# EasyEDA Pro project ProPrj_ESP32C3_UARTLogger_2025-09-07.epro, board PCB2
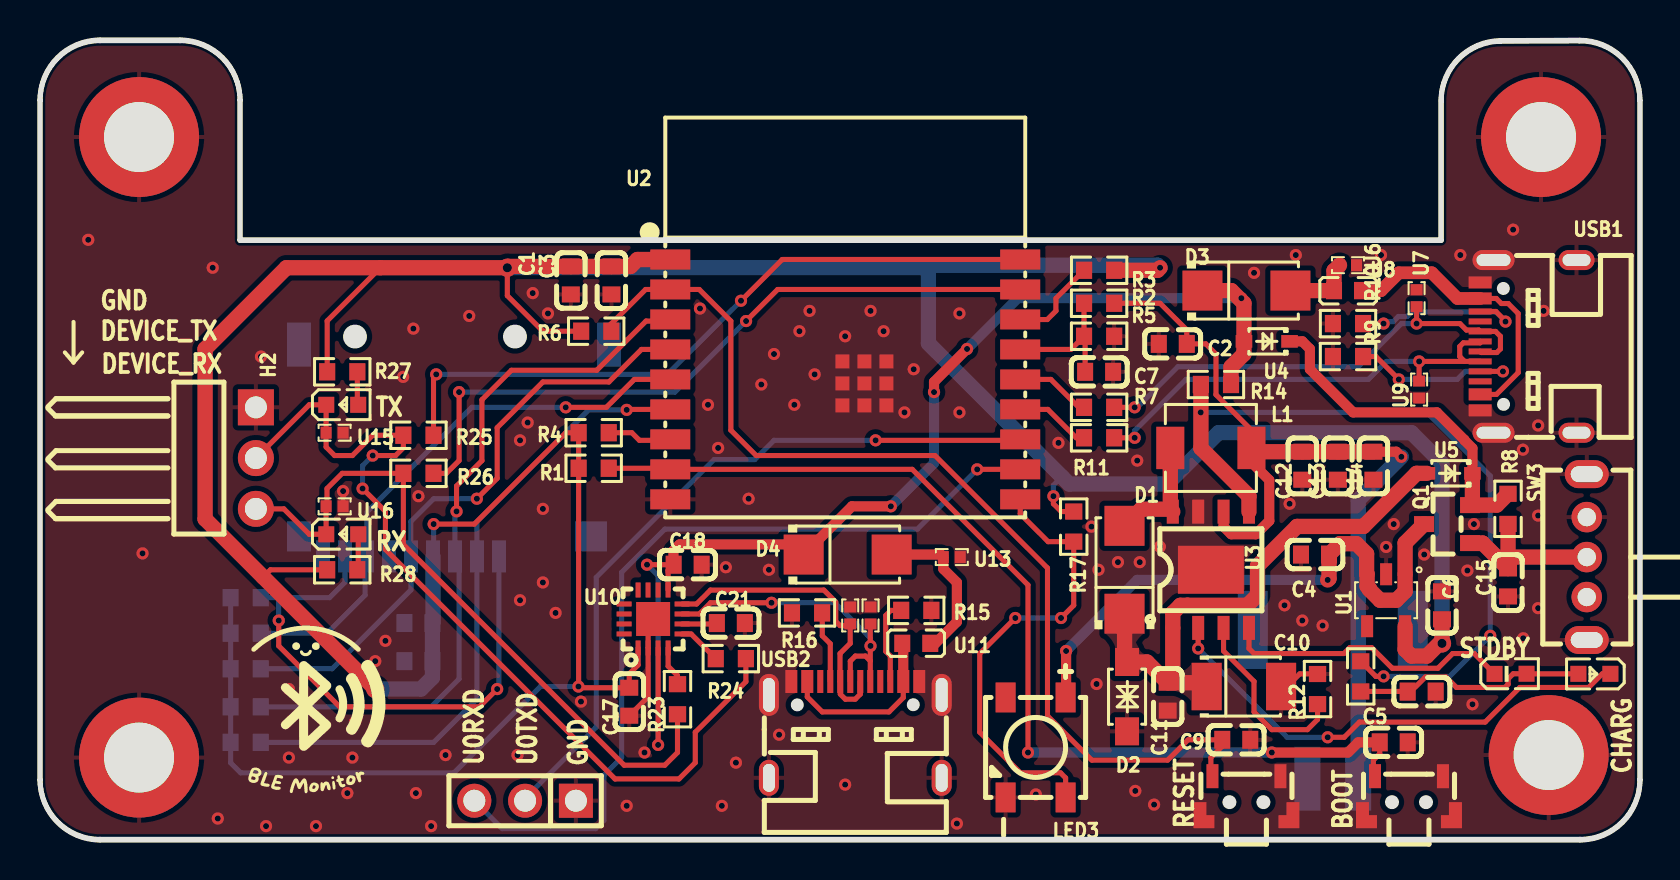
[diagram p4: board, top side]
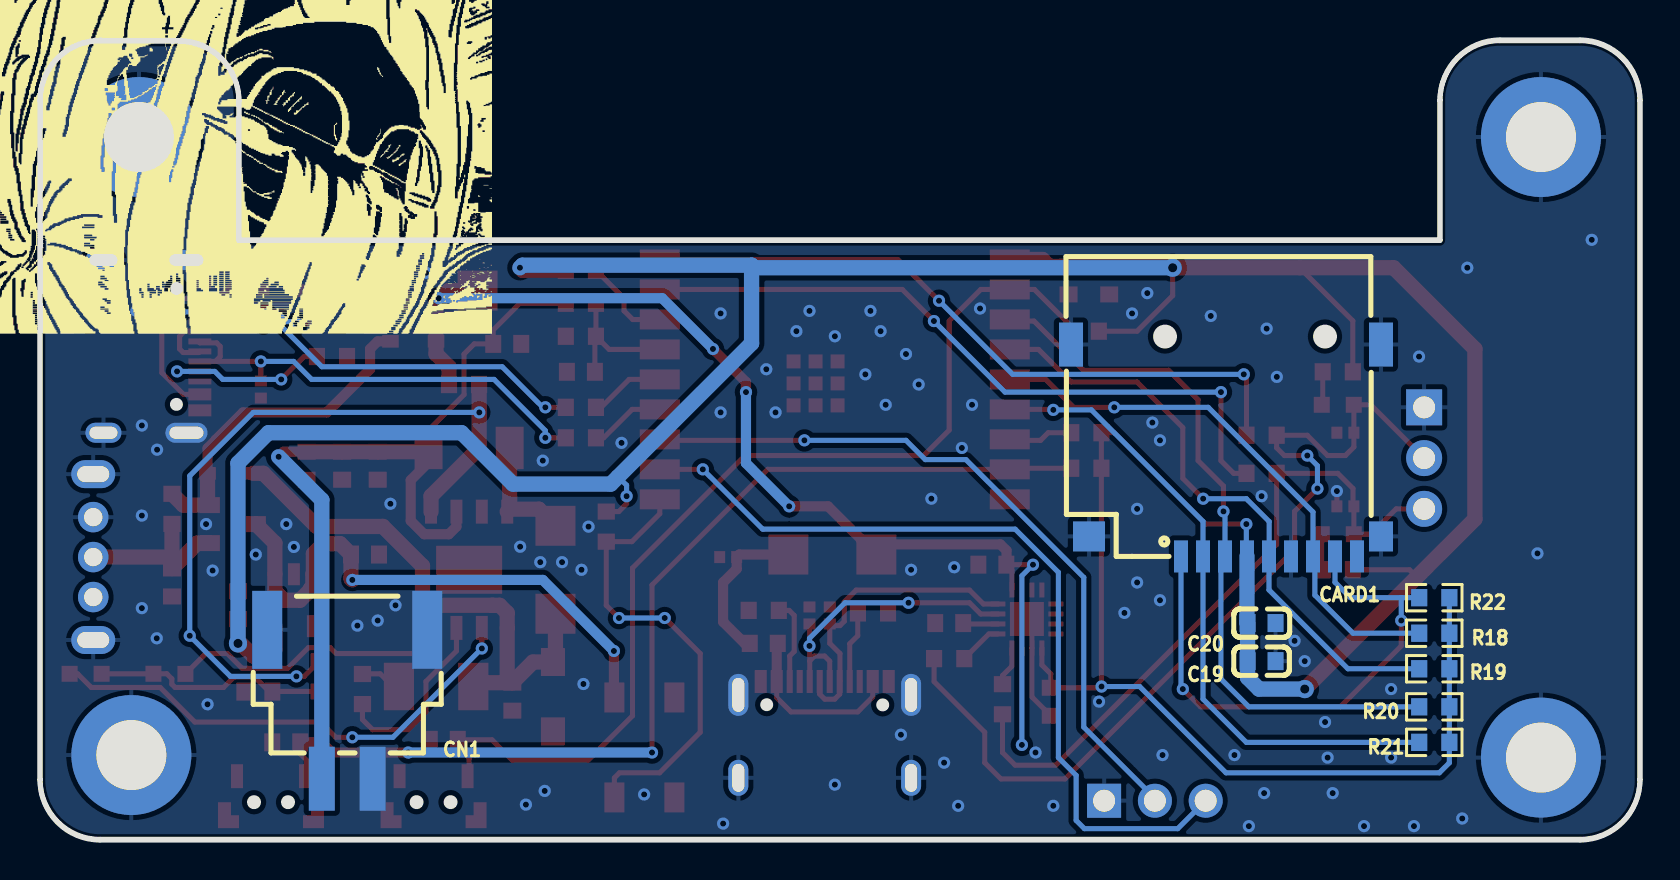
[diagram p5: board, bottom side, seen from below]

Outline 80 x 40.03 mm; copper layers: Top Layer, Bottom Layer. Coordinates in mm from the lower left corner of the outline.
Outline path: 0,37.03 arc(0.88,39.15) 3,40.03 7,40.03 arc(9.12,39.15) 10,37.03 10,30.03 70.06,30.03 70.06,37 arc(70.93,39.12) 73.04,40 76.99,40.02 arc(79.12,39.15) 80,37.02 80,3.03 arc(79.12,0.91) 77,0.03 3,0.03 arc(0.88,0.91) 0,3.03 0,37.03 ; 0,37 arc(0.88,39.12) 3,40 7,40 arc(9.13,39.12) 10,37 10,30 70.06,30 70.06,36.97 arc(70.94,39.08) 73.05,39.97 76.99,39.99 arc(79.12,39.11) 80,36.99 80,3 arc(79.13,0.88) 77,0 3,0 arc(0.88,0.88) 0,3 0,37
Stack: Top Layer 0.035mm / Dielectric1 1.51mm FR4 er 4.5 / Bottom Layer 0.035mm

## Design rules (mm)
template: JLCPCB Capability(Two Layers Board)
spacing copperThickness1oz (default): track to track 0.102, other pairs 0.152 to 0.3
spacing copperThickness2oz: track to track 0.203, other pairs 0.152 to 0.3
track width copperThickness1oz (default): min 0.127, default 0.254, max 2.54
track width copperThickness2oz: min 0.203, default 0.254, max 2.54
differential pair differentialPair (default): width min 0.127, default 0.254, max 2.54; gap min 0.152, default 0.152
via viaSize (default): diameter min 0.5, default 0.61, max 10; hole min 0.3, default 0.305, max 6.3

## Placement (name value [footprint] x y rotation side)
C1  10uF  [C0603]  26.54 28 90 top
C2  100nF  [C0603]  56.64 24.83 0 top
C3  100nF  [C0603]  28.57 28 90 top
C4  10uF  [C0603]  63.75 14.28 0 top
C5  100nF  [C0603]  67.69 4.89 0 top
C6  10uF  [C0603]  70.1 11.75 270 top
C7  100nF  [C0603]  52.96 23.43 180 top
C9  100nF  [C0603]  59.82 5.01 0 top
C10  100uF  [CASE-B_3528]  60.2 7.68 0 top
C11  1uF  [C0603]  56.39 7.17 270 top
C12  100nF  [C0603]  63.12 18.73 90 top
C13  22uF  [C0603]  64.9 18.73 90 top
C14  22uF  [C0603]  66.68 18.73 90 top
C15  100nF  [C0603]  73.41 12.89 90 top
C16  22uF  [C0603]  69.09 7.43 180 top
C17  100nF  [C0603]  29.46 6.92 270 top
C18  100nF  [C0603]  32.38 13.78 0 top
C19  10uF  [C0603]  18.92 8.95 0 bottom
C20  100nF  [C0603]  18.92 10.86 0 bottom
C21  100nF  [C0603]  34.54 10.86 180 top
CARD1  TF PUSH  [TF-SMD_TF-PUSH]  20.7 19.49 0 bottom
CN1  2.54-2A-WT  [CONN-SMD_2.54-2A-WT]  64.64 6.79 0 bottom
D1  SS32  [SMA_L4.3-W2.6-LS5.2-RD]  54.23 13.52 90 top
D2  SMF6.5CA  [SOD-123FL_L2.7-W1.8-LS3.8-BI]  54.36 7.17 90 top
D3  SS22  [SMA_L4.3-W2.6-LS5.2-RD]  60.32 27.49 0 top
D4  SS22  [SMA_L4.3-W2.6-LS5.2-RD]  40.39 14.28 0 top
H1  PZ254V-11-03P  [HDR-TH_3P-P2.54-V-M]  24.26 1.97 180 top
H2  PZ254R-11-03P  [HDR-TH_3P-P2.54-H-M-W10.4]  10.8 19.11 270 top
L1  10uH  [IND-SMD_L4.4-W4.2]  58.55 19.62 180 top
LED1  MHT192UGCT  [LED0603-RD_GREEN]  73.53 8.32 0 top
LED2  MHT192WDT-ICE  [LED0603-RD]  77.72 8.32 180 top
LED3  XL-5050RGBC-WS2812B  [LED-SMD_4P-L5.0-W5.0-BL_XL-5050RGBC]  49.78 4.63 180 top
LED4  LTST-C190KSKT  [LED0603-RD]  15.11 21.78 0 top
LED5  LTST-C190KSKT  [LED0603-RD]  15.11 15.3 0 top
NOREF  -  [Pad_e2103]  75.06 35.18 0 top
NOREF#2  -  [Pad_e2097]  4.95 4.12 0 top
NOREF#3  -  [Pad_e2102]  4.95 35.18 0 top
NOREF#4  -  [Pad_e376]  75.44 4.25 0 top
Q1  AO3401A  [SOT-23_L2.9-W1.3-P1.90-LS2.4-BR]  70.36 15.81 0 top
R1  10kΩ  [R0603]  27.69 18.6 0 top
R2  100kΩ  [R0603]  52.96 26.86 0 top
R3  10kΩ  [R0603]  52.96 28.51 180 top
R4  10kΩ  [R0603]  27.69 20.38 0 top
R5  100kΩ  [R0603]  52.96 25.21 180 top
R6  10kΩ  [R0603]  27.81 25.46 0 top
R7  0Ω  [R0603]  52.96 21.65 180 top
R8  100kΩ  [R0603]  73.41 16.57 90 top
R9  5.1kΩ  [R0603]  65.41 24.19 180 top
R10  5.1kΩ  [R0603]  65.41 25.84 180 top
R11  0Ω  [R0603]  52.96 20.13 180 top
R12  1.1kΩ  [R0603]  63.88 7.55 270 top
R13  10kΩ  [R0603]  66.04 8.19 90 top
R14  300mΩ  [R0603]  58.8 22.79 180 top
R15  5.1kΩ  [R0603]  43.81 11.49 0 top
R16  5.1kΩ  [R0603]  38.35 11.36 180 top
R17  10kΩ  [R0603]  51.69 15.68 90 top
R18  10kΩ  [R0603]  10.29 10.35 180 bottom
R19  10kΩ  [R0603]  10.29 8.57 180 bottom
R20  10kΩ  [R0603]  10.29 6.67 180 bottom
R21  10kΩ  [R0603]  10.29 4.89 180 bottom
R22  10kΩ  [R0603]  10.29 12.13 180 bottom
R23  0Ω  [R0603]  31.88 7.05 270 top
R24  0Ω  [R0603]  34.54 9.08 0 top
R25  0Ω  [R0603]  18.92 20.25 0 top
R26  0Ω  [R0603]  18.92 18.35 0 top
R27  10kΩ  [R0603]  15.11 23.43 0 top
R28  10kΩ  [R0603]  15.11 13.52 0 top
SW1  TS24CA  [SW-SMD_TS24CA]  68.45 2.22 180 top
SW2  TS24CA  [SW-SMD_TS24CA]  60.32 2.22 180 top
SW3  SK12D07VG4  [SW-TH_SK12D07VG4]  77.34 14.16 90 top
U1  ME6217C33M5G  [SOT-23-5_L3.0-W1.7-P0.95-LS2.8-BR]  67.31 12 90 top
U2  2.4GHz  [BULETM-SMD_ESPRESSIF_ESP32-C3-WROOM-02-N4-4MB]  40.26 23.05 0 top
U3  TP5400  [ESOP-8_L4.9-W3.9-P1.27-LS6.0-BL-EP]  58.55 13.52 0 top
U4  1N5817WS  [SOD-323_L1.7-W1.3-LS2.6-RD-1]  61.34 24.95 180 top
U5  1N5817WS  [SOD-323_L1.7-W1.3-LS2.6-RD-1]  70.49 18.35 180 top
U6  UPZ1608U221-2R2TF  [L0603]  65.41 27.49 180 top
U7  RCLAMP0521T-ES  [DFN1006-2L-BI]  68.83 27.11 90 top
U8  RCLAMP0521T-ES  [DFN1006-2L-BI]  65.41 28.76 180 top
U9  RCLAMP0521T-ES  [DFN1006-2L-BI]  68.96 22.54 270 top
U10  CH343P  [TQFN-16_L3.0-W3.0-P0.50-BL-EP1.7]  30.66 11.06 0 top
U11  UPZ1608U221-2R2TF  [L0603]  43.81 9.84 0 top
U12  RCLAMP0521T-ES  [DFN1006-2L-BI]  41.53 11.24 90 top
U13  RCLAMP0521T-ES  [DFN1006-2L-BI]  45.59 14.16 180 top
U14  RCLAMP0521T-ES  [DFN1006-2L-BI]  40.51 11.24 90 top
U15  RCLAMP0521T-ES  [DFN1006-2L-BI]  14.73 20.38 0 top
U16  RCLAMP0521T-ES  [DFN1006-2L-BI]  14.73 16.7 0 top
USB1  TYPEC-304-ACP16  [USB-C-SMD_TYPE-C-16P-1]  74.42 24.7 90 top
USB2  TYPEC-304-ACP16  [USB-C-SMD_TYPE-C-16P-1]  40.77 5.52 0 top

## Footprints (pads in the part's own frame, mm; a bottom-side part is the same pattern mirrored in y, then rotated)
BULETM-SMD_ESPRESSIF_ESP32-C3-WROOM-02-N4-4MB
  rect 2x1 smd: 1(-8.75,6) 2(-8.75,4.5) 3(-8.75,3) 4(-8.75,1.5) 5(-8.75,0) 6(-8.75,-1.5) 7(-8.75,-3) 8(-8.75,-4.5) 9(-8.75,-6) 10(8.75,-6) 11(8.75,-4.5) 12(8.75,-3) 13(8.75,-1.5) 14(8.75,0) 15(8.75,1.5) 16(8.75,3) 17(8.75,4.5) 18(8.75,6)
  rect 0.7x0.7 smd: 19(-0.14,0.9) 19(-0.14,-0.2) 19(-0.14,-1.3) 19(0.96,0.9) 19(0.96,-0.2) 19(0.96,-1.3) 19(2.06,0.9) 19(2.06,-0.2) 19(2.06,-1.3)
C0603
  rect 0.8x0.9 smd: 1(-0.7,0) 2(0.7,0)
CASE-B_3528
  rect 1.506x2.376 smd: 1(-1.861,0) 2(1.861,0)
CONN-SMD_2.54-2A-WT
  rect 1.3x3.2 smd: 1(-1.27,3.725) 2(1.27,3.725)
  rect 1.5x3.9 smd: 3(-4,-3.725) 4(4,-3.725)
DFN1006-2L-BI
  rect 0.55x0.6 smd: 1(-0.425,0) 2(0.425,0)
ESOP-8_L4.9-W3.9-P1.27-LS6.0-BL-EP
  rect 0.6x1.2 smd: 1(-1.905,-2.909) 2(-0.635,-2.909) 3(0.635,-2.909) 4(1.905,-2.909) 5(1.905,2.909) 6(0.635,2.909) 7(-0.635,2.909) 8(-1.905,2.909)
  rect 3.3x2.4 smd: 9(0,0)
HDR-TH_3P-P2.54-H-M-W10.4
  rect 1.8x1.8 hole 1.1: 1(-2.54,0)
  round 1.8 hole 1.1: 2(0,0) 3(2.54,0)
HDR-TH_3P-P2.54-V-M
  rect 1.7x1.7 hole 1.1: 1(-2.54,0)
  round 1.7 hole 1.1: 2(0,0) 3(2.54,0)
IND-SMD_L4.4-W4.2
  rect 1.4x2.12 smd: 1(2.028,0) 2(-2.028,0)
L0603
  rect 0.8x0.864 smd: 1(-0.7,0) 2(0.7,0)
LED0603-RD
  rect 0.8x0.8 smd: 1(-0.799,0) 2(0.799,0)
LED0603-RD_GREEN
  rect 0.8x0.8 smd: 1(-0.799,-0.004) 2(0.799,0.004)
LED-SMD_4P-L5.0-W5.0-BL_XL-5050RGBC
  rect 1x1.5 smd: 1(-1.5,-2.5) 2(1.5,-2.5) 3(1.5,2.5) 4(-1.5,2.5)
Pad_e376
  round 6 hole 3.5: 1(0,0)
Pad_e2097
  round 6 hole 3.5: 1(0,0)
Pad_e2102
  round 6 hole 3.5: 1(0,0)
Pad_e2103
  round 6 hole 3.5: 1(0,0)
R0603
  rect 0.806x0.864 smd: 1(-0.753,0) 2(0.753,0)
SMA_L4.3-W2.6-LS5.2-RD
  rect 2x2 smd: 1(-2.2,0) 2(2.2,0)
SOD-123FL_L2.7-W1.8-LS3.8-BI
  rect 1.4x1.2 smd: 1(-1.735,0) 2(1.735,0)
SOD-323_L1.7-W1.3-LS2.6-RD-1
  rect 0.83x0.63 smd: 1(-1.14,0) 2(1.14,0)
SOT-23-5_L3.0-W1.7-P0.95-LS2.8-BR
  rect 1.1x0.6 smd: 1(1.3,-0.95) 2(1.3,0) 3(1.3,0.95) 4(-1.3,0.95) 5(-1.3,-0.95)
SOT-23_L2.9-W1.3-P1.90-LS2.4-BR
  rect 1x0.8 smd: 1(1.15,-0.95) 2(1.15,0.95) 3(-1.15,0)
SW-SMD_TS24CA
  custom 1.05x1.3 smd: 1(-2.125,0.975) 2(2.125,0.975)
  rect 0.6x1.2 smd: 3(-1.7,-0.975) 4(1.7,-0.975)
SW-TH_SK12D07VG4
  round 1.524 hole 0.914: 1(-2,0) 2(0,0) 3(2,0)
  oval 1.4x2.2 hole 0.8x1.6: 4(4.15,0) 5(-4.15,0)
TF-SMD_TF-PUSH
  rect 0.7x1.6 smd: 1(2.25,5.3) 2(1.15,5.3) 3(0.05,5.3) 4(-1.05,5.3) 5(-2.15,5.3) 6(-3.25,5.3) 7(-4.35,5.3) 8(-5.45,5.3) CD(-6.55,5.3)
  rect 1.2x1.5 smd: 10(-7.75,4.3)
  rect 1.2x2.2 smd: 11(-7.75,-5.3) 12(7.75,-5.3)
  rect 1.6x1.5 smd: 13(6.85,4.3)
TQFN-16_L3.0-W3.0-P0.50-BL-EP1.7
  rect 0.25x0.75 smd: 1(-0.749,-1.45) 2(-0.248,-1.45) 3(0.252,-1.45) 4(0.751,-1.45) 9(0.75,1.45) 10(0.25,1.45) 11(-0.25,1.45) 12(-0.749,1.45)
  rect 0.75x0.25 smd: 5(1.45,-0.75) 6(1.45,-0.25) 7(1.45,0.25) 8(1.45,0.75) 13(-1.45,0.75) 14(-1.45,0.25) 15(-1.45,-0.25) 16(-1.45,-0.75)
  rect 1.7x1.7 smd: 17(0.001,0)
USB-C-SMD_TYPE-C-16P-1
  rect 0.6x1.15 smd: A1B12(-3.2,2.41) A4B9(-2.4,2.41) B1A12(3.2,2.41) B4A9(2.4,2.41)
  rect 0.3x1.15 smd: A5(-1.25,2.41) A6(-0.25,2.41) A7(0.25,2.41) A8(1.25,2.41) B5(1.75,2.41) B6(0.75,2.41) B7(-0.75,2.41) B8(-1.75,2.41)
  oval 1x2.1 hole 0.6x1.7: EP(-4.32,1.74) EP(4.32,1.74)
  oval 1x1.8 hole 0.6x1.4: EP(-4.32,-2.41) EP(4.32,-2.41)

## Nets
As in the schematic, except:
GND: C1.1 C2.1 C3.1 C4.1 C5.2 C6.1 C7.1 C9.2 C10.2 C11.2 C12.1 C13.1 C14.1 C15.1 C16.1 C17.2 C18.2 C19.1 C20.1 C21.1 CARD1.6 CARD1.10 CARD1.11 CARD1.12 CARD1.13 CN1.1 CN1.3 CN1.4 D2.1 H1.1 H2.1 LED3.3 NOREF.1 NOREF#2.1 NOREF#3.1 NOREF#4.1 R5.1 R9.2 R10.2 R12.1 R15.2 R16.2 SW1.1 SW1.2 SW1.3 SW2.1 SW2.2 SW2.3 SW3.3 SW3.4 SW3.5 U1.2 U2.9 U2.19 U3.7 U3.9 U7.2 U8.1 U9.2 U10.2 U10.17 U12.2 U13.1 U14.2 U15.2 U16.2 USB1.A1B12 USB1.B1A12 USB1.EP USB2.A1B12 USB2.B1A12 USB2.EP

Pads without a net: CARD1 CD; LED3 2; SW3 1; U1 4; U10 10 11 12 13 14 15 16; USB1 A8 B8; USB2 A8 B8

## Via types
v1: diameter 0.61, hole 0.305, Top Layer to Bottom Layer, 136 vias
v2: diameter 0.914, hole 0.457, Top Layer to Bottom Layer, 3 vias

## Routing (per net, layer and track width the routed paths; a pad name or vN(x,y) marks a point on that pad's centre or on a via; arc(x,y) is an arc through that point)
GND: length 8.2
  Top Layer w0.254: U10.17 30.41,10.81 U10.2 30.41,7.16 C17.2 ; R12.1 63.87,8.32 62.99,8.32 62.36,7.68 C10.2 ; U16.2 v1(15.16,17.46)
  vias: v1(2.41,30.03) v1(5.13,14.34) v1(8.64,28.64) v1(8.89,1.08) v1(11.05,24.19) v1(11.3,0.7) v1(12.45,7.55) v1(12.45,4.12) v1(13.8,0.7) v1(15.37,2.35) v1(15.62,4.12) v1(15.75,5.9) v1(16.76,8.95) v1(17.27,9.97) v1(18.16,23.17) v1(18.67,25.59) v1(18.8,2.35) v1(18.92,17.21) v1(19.56,0.7) v1(20.28,4.25) v1(21.46,26.22) v1(23.88,4.25) v1(24,20) v1(24,12) v1(24.38,20.89) v1(24.64,27.37) v1(25.15,16.57) v1(25.15,12.89) v1(25.4,26.35) v1(25.78,11.36) v1(27.05,6.93) v1(29.34,1.71) v1(30.23,4.38) v1(33,26.6) v1(33.4,21.78) v1(33.91,19.62) v1(34.09,1.71) v1(34.29,13.65) v1(34.8,3.87) v1(35.43,17.08) v1(36.07,22.79) v1(36.45,13.52) v1(36.7,24.32) v1(36.96,5.27) v1(37.72,21.78) v1(37.97,25.46) v1(38.48,26.48) v1(38.74,23.3) v1(40.26,25.21) v1(40.26,2.77) v1(41.53,26.48) v1(42.18,25.46) v1(43.23,21.4) v1(43.69,23.56) v1(45.85,0.82) v1(45.97,26.35) v1(45.97,21.4) v1(49.8,2.28) v1(50.93,19.87) v1(52.58,15.68) v1(52.83,7.81) v1(52.93,13.52) v1(53.9,13.9) v1(54.77,2.46) v1(54.86,18.98) v1(54.99,13.9) v1(55.71,1.77) v1(56,14.68) v1(60.71,28.38) v1(62.23,11.75) v1(62.48,16.83) v1(62.79,29.27) v1(63.12,10.98) v1(64.13,10.73) v1(67.06,29.27) v1(67.31,14.67) v1(67.69,15.81) v1(69.22,14.28) v1(71.02,29.27) v1(71.37,13.48) v1(71.63,6.79) v1(71.7,15.81) v1(73.66,30.54) v1(74.15,19.53) v1(74.17,10.09) v1(74.91,20.74) v1(74.91,16.23) v1(74.91,11.6) v1(75.18,26.48)
VBAT5V: length 27
  Top Layer w0.762: C11.1 56.64,8.13 U3.1 56.64,11.36 57.02,11.75 57.39,11.75 57.39,11.75 60.38,11.75 60.88,12.25 60.88,13.71 62.86,15.69 66.18,15.69 68.83,18.35 69.34,18.35 ; C11.1 58.15,7.87 C10.1 ; C11.1 55.35,8.91 D2.2 54.23,9.03 D1.1
VBUS: length 60.6
  Top Layer w0.254: U10.9 31.41,13.5 31.68,13.77 ; v1(30.35,13.78) 31.67,13.78 31.68,13.77 ; U10.3 v1(30.91,4.76) ; 31.68,13.77 C18.1
  Top Layer w0.508: v1(44.7,22.41) 44.7,22.92 v1(46.35,24.57) ; v1(42.54,16.7) 40.6,16.7 D4.1 37.68,14.79 31.98,14.79 31.68,14.49 31.68,13.77
  Top Layer w0.762: R14.1 59.55,23.67 60.2,24.32 60.2,26.86 59.57,27.49 D3.1
  Bottom Layer w0.254: v1(30.91,4.76) 30.91,13.22 v1(30.35,13.78)
  Bottom Layer w0.508: v1(44.7,22.41) 44.7,18.86 v1(42.54,16.7) ; v1(60.07,27.11) 48.9,27.11 v1(46.35,24.57)
VCC: length 211.9
  Top Layer w0.254: 17.02,28.64 14.36,25.98 R27.1 ; R28.1 11.53,13.52 11.16,13.16 ; U10.1 29.91,8.76 29.46,8.32 C17.1 26.99,7.62 v1(26.92,7.68) 26.93,7.69 R1.1 R4.1 26.29,20.38 21.72,15.81 v1(19.69,15.81) ; R6.1 25.15,25.46 23.37,27.24 v2(23.37,28.64) ; v1(50.67,17.21) 50.67,16.83 51.06,16.44 R17.2
  Top Layer w0.762: C6.2 70.1,9.97 ; 70.1,9.97 v2(70.1,9.84) ; 70.1,9.97 69.34,9.2 68.58,9.2 68.26,9.53 U1.5 ; R3.1 55.88,28.51 v1(56.01,28.64) ; U2.1 29.88,29.05 29.53,28.7 C3.2 C1.2 23.43,28.7 v2(23.37,28.64) 12.32,28.64 8.25,24.57 8.25,16.06 v2(16.76,7.55)
  Bottom Layer w0.254: v1(26.92,7.68) 25.02,7.68 20.7,3.36 10.03,3.36 9.53,3.86 R21.2 R20.2 R19.2 R18.2 R22.2 ; v1(50.67,17.21) 50.67,17.75 51.1,18.18 ; v1(19.69,15.81) 19.69,14.23 19.65,14.19
  Bottom Layer w0.762: v2(70.1,9.84) 70.1,18.86 68.58,20.38 58.93,20.38 56.36,17.81 51.47,17.81 44.42,24.85 44.42,28.76 ; v2(23.37,28.64) 44.3,28.64 44.42,28.76 ; 44.42,28.76 55.88,28.76 v1(56.01,28.64) ; 19.65,14.19 19.65,10.88 C20.2 C19.2 19.62,8.13 19.05,7.55 v2(16.76,7.55)
VCC5V: length 28.3
  Top Layer w0.508: v1(51.31,9.46) 51.31,7.16 LED3.1
  Top Layer w0.762: v1(64.39,13.02) 64.45,13.08 C4.2 65,14.83 65.83,14.83 66.33,14.32 66.33,13.33 U1.3 66.36,12.7 66.48,12.58 66.48,12.53 67.01,12 67.82,12 68.26,12.44 U1.1 68.26,14.86 Q1.3
  Bottom Layer w0.508: v1(51.31,9.46) 54.86,13.02 v1(64.39,13.02)
BAT+: length 44.7
  Top Layer w0.254: L1.2 60.57,20.51 58.8,22.29 58.8,24.32 58.29,24.83 C2.2 57.34,25.52 56.01,26.86 R2.2
  Top Layer w0.508: L1.2 60.57,18.9 61.47,18.01 61.47,15.97 60.8,15.3 59.56,15.3 59.18,15.68 U3.6 ; v1(68.07,19.18) 67.82,19.43 C14.2
  Top Layer w0.762: C14.2 C13.2 C12.2 60.76,19.43 L1.2
  Bottom Layer w0.762: 65.91,2.56 65.91,17.02 v1(68.07,19.18)
D+: length 23.9
  Top Layer w0.254: R7.1 v1(54.74,21.65) ; USB1.A6 72.07,24.39 72.85,24.39 73.03,24.57 73.03,25.21 72.78,25.45 USB1.B6 71.94,25.52 71.32,25.52 71,25.84 v1(68.83,25.84) U7.1
  Bottom Layer w0.254: v1(54.74,21.65) 54.86,21.65 56.9,23.68 65.91,23.68 68.07,25.84 v1(68.83,25.84)
D+_UART_OUT: length 15.9
  Top Layer w0.254: U12.1 41.52,10.8 41.52,9.7 ; v1(41.53,9.71) 41.53,9.71 41.52,9.7 ; 41.52,9.7 41.52,8.96 ; 41.52,8.96 41.28,9.2 40.77,9.2 40.52,8.95 USB2.A6 ; 41.52,8.96 USB2.B6 ; v1(36.58,11.87) 33.53,11.87 32.97,11.31 U10.7
  Bottom Layer w0.254: v1(41.53,9.71) 41.53,10.09 39.75,11.87 v1(36.58,11.87)
D-: length 23.1
  Top Layer w0.254: USB1.A7 72.01,24.88 71.17,24.88 70.99,24.7 70.99,24.19 71.24,23.95 ; USB1.B7 71.24,23.95 ; 71.24,23.95 v1(68.96,23.95) U9.1 ; v1(54.74,20.13) R11.1
  Bottom Layer w0.254: v1(54.74,20.13) 54.74,20.49 57.3,23.05 66.42,23.05 67.32,23.95 v1(68.96,23.95)
D-_UART_OUT: length 15.6
  Top Layer w0.254: U10.8 32.83,11.81 33.53,12.51 39.19,12.51 39.79,11.91 39.79,10.94 40,10.73 40.43,10.73 U14.1 40.51,9.84 40,9.33 40,7.94 USB2.B7 40.02,7.3 40.27,7.05 40.76,7.05 41.02,7.3 USB2.A7
DEVICE_RX: length 34.5
  Top Layer w0.254: H2.3 12.19,16.57 13.46,15.3 LED5.1 14.31,15.31 U16.1 14.35,16.74 14.35,17.59 15.11,18.35 R26.1 18.17,14.78 29.21,3.74 31.24,3.74 31.88,4.38 R23.2
DEVICE_TX: length 45.7
  Top Layer w0.254: H2.2 13.46,21.78 LED4.1 14.31,21.77 U15.1 14.31,19.66 14.73,19.24 15.62,19.24 16.64,20.25 R25.1 18.17,19.63 17.78,19.24 v1(16.64,19.24) ; v1(16.13,17.59) 17.27,16.44 17.27,14.54 28.75,3.06 31.95,3.06 32.77,3.87 32.77,5.39 35.3,7.93 R24.2
  Bottom Layer w0.254: v1(16.13,17.59) 16.13,18.73 v1(16.64,19.24)
IO0_RX: length 34.7
  Top Layer w0.254: v1(19.81,23.3) 19.68,23.17 R25.2 ; U2.18 37.12,29.05 v1(35.05,26.98)
  Bottom Layer w0.254: v1(35.05,26.98) 31.37,23.3 v1(19.81,23.3)
IO1_TX: length 35.2
  Top Layer w0.254: v1(20.96,22.41) 20.96,18.98 20.32,18.35 R26.2 ; v1(35.31,25.97) 36.88,27.55 U2.17
  Bottom Layer w0.254: v1(35.31,25.97) 31.75,22.41 v1(20.96,22.41)
IO2: length 4.6
  Top Layer w0.254: U2.16 49.02,26.04 50.37,26.04 50.8,26.48 50.8,27.1 R3.2
IO3_BAT_MON: length 6.9
  Top Layer w0.254: U2.15 51.55,24.55 R5.2 ; R5.2 52.26,25.15 C7.2 ; R5.2 R2.1
IO4_MOSI: length 36.2
  Top Layer w0.254: U2.3 31.44,25.97 30.3,25.97 27.84,23.5 23.57,23.5 22.1,22.03 22.1,18.98 20.83,17.71 v1(20.83,16.44)
  Bottom Layer w0.254: v1(20.83,16.44) 20.75,16.37 CARD1.3 20.96,13.99 20.96,8.06 19.56,6.67 R20.1
IO5_CLK: length 30.6
  Top Layer w0.254: U2.4 30.07,24.55 28.45,22.92 25.15,22.92 22.86,20.64 22.86,18.09 v1(21.84,17.08)
  Bottom Layer w0.254: v1(21.84,17.08) 19.69,17.08 18.54,15.94 18.54,14.2 CARD1.5 18.55,12.52 14.61,8.57 R19.1
IO6_MISO: length 28.1
  Top Layer w0.254: v1(26.29,21.65) 28.32,21.65 29.72,23.05 U2.5
  Bottom Layer w0.254: v1(26.29,21.65) 21.59,21.65 16.35,16.41 CARD1.7 16.26,14.1 16.26,12.25 14.35,10.35 R18.1
IO7_CS: length 32.6
  Top Layer w0.254: U2.6 29.36,21.55 v1(29.34,21.52)
  Bottom Layer w0.254: R21.1 19.69,4.89 21.85,7.05 CARD1.2 21.85,15.94 27.43,21.52 v1(29.34,21.52)
IO9_BOOT: length 51.4
  Top Layer w0.254: R1.2 31.46,18.6 U2.8 43.62,18.55 49.4,12.76 v1(49.4,4.38) ; SW1.4 66.68,3.27 66.68,4 66.99,4.31 C5.1
  Top Layer w0.508: v1(61.59,4.38) 65.41,4.38 65.91,4.89 C5.1
  Bottom Layer w0.508: v1(49.4,4.38) v1(61.59,4.38)
IO10_RMT_DOUT: length 23
  Top Layer w0.254: LED3.4 51.28,3.11 51.03,3.36 49.02,3.36 46.99,5.39 46.99,9.33 v1(48.77,11.11) ; U2.10 49.01,16.32 50.41,14.93 R17.1 51.69,11.75 v1(51.05,11.11)
  Bottom Layer w0.254: v1(51.05,11.11) v1(48.77,11.11)
IO18_D-: length 3.8
  Top Layer w0.254: U2.13 50.4,21.55 51.82,20.13 R11.2
IO19_D+: length 3.8
  Top Layer w0.254: U2.14 50.55,23.05 51.94,21.65 R7.2
RESET: length 51.4
  Top Layer w0.254: R6.2 28.57,25.83 30.28,27.55 U2.2 32.97,27.55 34.54,25.97 34.54,20.51 35.81,19.24 44.75,19.24 50.38,13.61 50.38,6.22 52.59,4 56.39,4 57.4,5.01 59.12,5.01 59.12,4.7 58.55,4.12 58.55,3.27 SW2.4
U0RXD: length 42.1
  Top Layer w0.254: U2.11 v1(46.86,18.55)
  Bottom Layer w0.254: H1.3 23.11,0.57 27.78,0.57 28.19,0.98 28.19,3.24 29.08,4.12 29.08,13.4 31.24,15.56 43.87,15.56 v1(46.86,18.55)
U0TXD: length 36.7
  Top Layer w0.254: U2.12 48.97,20 v1(41.78,20)
  Bottom Layer w0.254: v1(41.78,20) 36.7,20 35.74,19.03 33.71,19.03 27.81,13.14 27.81,5.65 24.26,2.09 H1.2
$1N1037: length 3.3
  Top Layer w0.254: U2.7 31.47,20 29.97,20 29.59,20.38 R4.2
$1N2849: length 9.1
  Top Layer w0.254: v1(73.28,25.94) 73.28,25.97 72.8,26.45 USB1.B5 ; v1(67.18,25.84) R10.1
  Bottom Layer w0.254: v1(73.28,25.94) 72.79,26.43 68.59,26.43 68.36,26.2 67.92,26.2 67.67,25.94 67.28,25.94 v1(67.18,25.84)
$1N2855: length 14.3
  Top Layer w0.254: USB1.B4A9 72.82,27.1 73.07,26.84 73.42,26.84 73.91,26.35 73.91,23.39 72.83,22.3 USB1.A4B9
  Top Layer w0.635: U6.1 67.06,27.49 67.94,28.38 69.6,28.38 70.88,27.1 USB1.B4A9
$1N2861: length 8.8
  Top Layer w0.254: USB1.A5 v1(73.15,23.45) ; R9.1 66.8,24.19 v1(67.94,23.05)
  Bottom Layer w0.254: v1(73.15,23.45) 71.27,23.45 70.87,23.05 v1(67.94,23.05)
$1N3712: length 1.8
  Top Layer w0.254: C21.2 33.8,10.81 U10.6
$1N4143: length 8.9
  Top Layer w0.254: USB2.B4A9 43.17,7.13 42.45,6.41 39.12,6.41 38.37,7.16 USB2.A4B9
  Top Layer w0.508: USB2.B4A9 43.17,9.83
$1N4164: length 3.6
  Top Layer w0.254: USB2.A5 39.52,9.82 39.12,10.22 39.12,11.36 R16.1
$1N5573: length 4.3
  Top Layer w0.254: R15.1 42.54,11.49 42.29,11.24 42.29,9.44 42.52,9.21 USB2.B5
$1N5644: length 7.9
  Top Layer w0.508: U11.2 44.77,9.84 45.85,10.92 45.85,12.89 45.17,13.57 U13.2 45.04,14.28 D4.2
$1N5686: length 3.6
  Top Layer w0.762: U8.2 64.71,28.49 U6.2 D3.2
$1N9313: length 5.9
  Top Layer w0.762: 56.52,16.55 U3.8 ; 56.52,16.55 55.06,16.55 D1.2 ; 56.52,16.55 L1.1
$1N9314: length 9.4
  Top Layer w0.254: R12.2 63.88,6.03 63.37,5.52 61.59,5.52 60.71,6.41 60.71,7.94 59.18,9.46 U3.3
$1N9315: length 14.7
  Top Layer w0.254: LED1.1 71.71,9.33 70.64,9.33 69.9,8.59 67.62,8.59 66.59,9.62 65.49,9.62 65.2,9.33 60.71,9.33 60.45,9.59 U3.4
$1N9316: length 24.8
  Top Layer w0.254: LED2.1 78.12,8.32 77.44,7.63 73.99,7.63 72.26,5.9 65.98,5.9 65.21,5.14 v1(64.39,5.14) ; U3.2 v1(57.91,9.59)
  Bottom Layer w0.254: v1(64.39,5.14) 62.36,5.14 v1(57.91,9.59)
$1N9317: length 38.8
  Top Layer w0.254: R13.2 66.79,8.19 v1(67.18,8.19) ; 58.04,22.79 R14.2
  Top Layer w0.762: R14.2 58.05,19.61 60.45,17.21 U3.5
  Bottom Layer w0.254: v1(58.04,21.4) 69.34,21.4 72.52,18.22 v1(72.52,10.22) 70.49,8.19 v1(67.18,8.19)
$1N9320: length 11.9
  Top Layer w0.254: LED2.2 74.34,8.32 LED1.2 73.66,8.32 73.41,8.07 73.41,7.8 73.25,7.63 70.83,7.63 70.3,8.16 69.27,8.16 68.54,7.43 C16.2 68.38,7.44 R13.1
$1N9326: length 17
  Top Layer w0.508: U5.1 71.62,19.6 71.23,20 71.23,20.02 69.85,21.4 65.66,21.4 63.5,23.56 63.5,24.57 63.12,24.95 U4.1
  Top Layer w0.762: R8.2 72.84,16.76 Q1.2 71.62,16.88 U5.1
$1N9327: length 8.6
  Top Layer w0.762: R8.1 73.41,14.1 ; 73.41,14.1 73.47,14.16 SW3.2 ; 73.41,14.1 C15.2 72.13,14.86 Q1.1
$1N15856: length 27.5
  Top Layer w0.254: v1(11.94,10.98) 11.94,9.71 14.99,6.67 21.97,6.67 v1(22.86,7.55)
  Bottom Layer w0.254: CARD1.1 22.95,7.64 v1(22.86,7.55) ; 11.93,12.13 11.94,12.12 v1(11.94,10.98) ; 11.93,12.13 14.48,12.13 15.25,12.9 15.25,14.19 ; 11.93,12.13 R22.1
$1N37074: length 2
  Top Layer w0.254: U10.4 31.41,8.7 31.88,8.23 R23.1
$1N37118: length 2.2
  Top Layer w0.254: U10.5 32.56,10.31 R24.1
$1N56887: length 1.7
  Top Layer w0.254: LED4.2 15.87,21.82 R27.2
$1N56895: length 1.8
  Top Layer w0.254: LED5.2 15.91,13.57 R28.2

## Copper pours and planes (outline as drawn; the poured copper is in the pictures)
GND on Top Layer: -0.89,44.13 81.41,44.13 81.41,-2.86 -0.89,-2.86
GND on Bottom Layer: -0.76,44 81.53,44 81.53,-3.11 -0.76,-3.11

Small or netless copper shapes (teardrops, artwork), in the pictures only: 4 on Top Layer

## Text on the board
Top Silkscreen Layer: GND | DEVICE_TX | DEVICE_RX | TX | RX | U0RXD | U0TXD | RESET | BOOT | CHARG | STDBY | ↓
